# EAGLE design cigpack-batt_aaa (EAGLE 4.13)
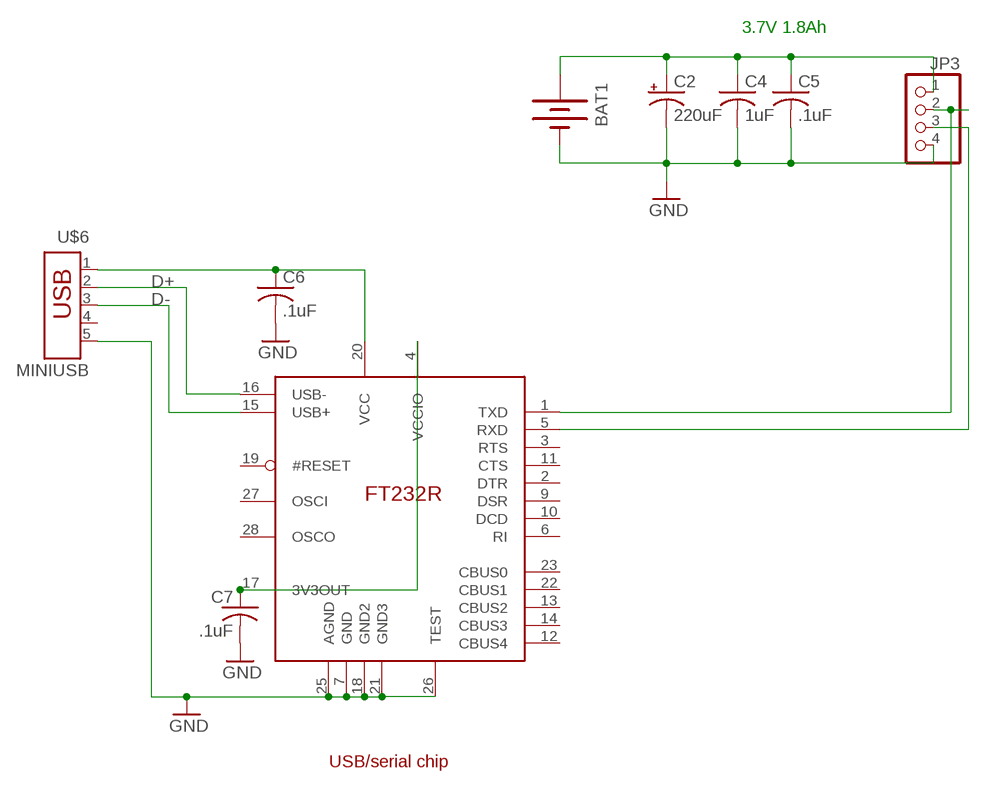
[diagram p0: schematic, sheet 1]

## Parts
BAT1  BATTERYAAA  [3AAA-PC]
C2  220uF  CPOL-US153CLV-0810  [153CLV-0810]
C4  1uF  C-USC3225  [C3225]
C5  .1uF  C-USC1206  [C1206]
C6  .1uF  C-USC1206  [C1206]
C7  .1uF  C-USC1206  [C1206]
IC2  FT232R  [TSSOP28]
JP3  PINHD-1X4  [1X04]
U$6  MINIUSB  [UX60A-MB-5SY]

## Nets
D+: IC2.16(USB-) U$6.2
D-: IC2.15(USB+) U$6.3
GND: BAT1.- C2.- C4.2 C5.2 C6.2 C7.2 IC2.7(GND) IC2.18(GND2) IC2.21(GND3) IC2.25(AGND) IC2.26(TEST) JP3.4 U$6.5
N$1: IC2.1(TXD) JP3.2
N$8: BAT1.+ C2.+ C4.1 C5.1 JP3.1
N$11: C6.1 IC2.20(VCC) U$6.1
N$17: C7.1 IC2.4(VCCIO) IC2.17(3V3OUT)
N$41: IC2.5(RXD) JP3.3
Unconnected: IC2.2(DTR) IC2.3(RTS) IC2.6(RI) IC2.9(DSR) IC2.10(DCD) IC2.11(CTS) IC2.12(CBUS4) IC2.13(CBUS2) IC2.14(CBUS3) IC2.19(#RESET) IC2.22(CBUS1) IC2.23(CBUS0) IC2.27(OSCI) IC2.28(OSCO) U$6.4

## Notes on the sheet
- 3.7V 1.8Ah
- USB/serial chip

## Library data of the parts
BAT1 = cleanair:BATTERY: BATTERY
C2 = rcl:CPOL-US: POLARIZED CAPACITOR, American symbol
C4-C7 = rcl:C-US: CAPACITOR, American symbol
IC2 = ft232:FT232R
JP3 = pinhead:PINHD-1X4: PIN HEADER
U$6 = cleanair:MINIUSB

## Board
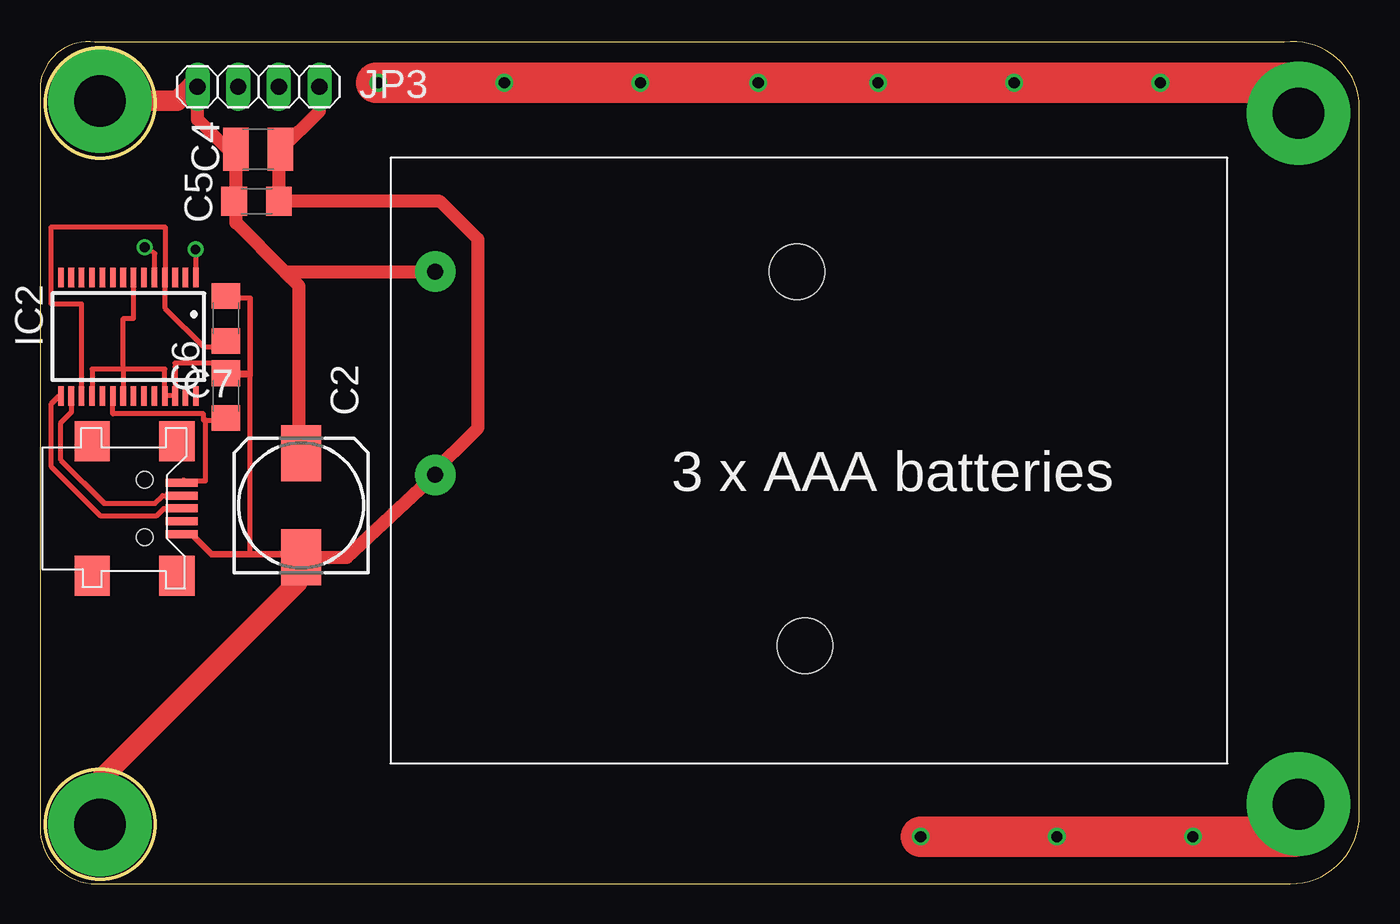
[diagram p1: board, top side]
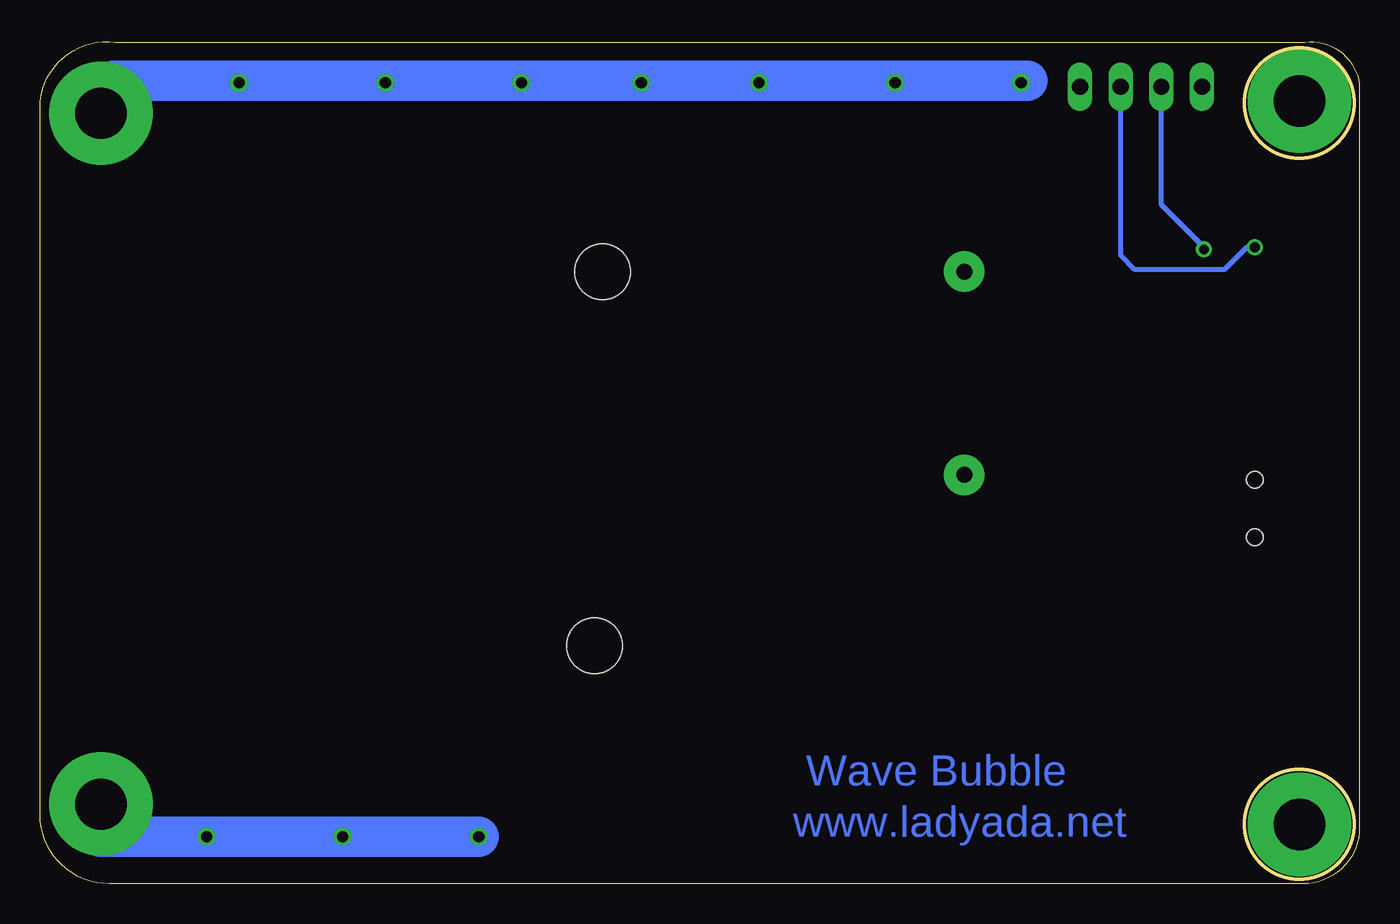
[diagram p2: board, bottom side, seen from below]

Size 82.49 x 52.63 mm. Coordinates in mm from the lower left corner, seen from the top.
Outline: 3.43,52.6 arc90 0,49.93 0,3.52 arc90 3.52,0 78.16,0 arc90 82.49,4.33 82.49,48.9 arc90 77.78,52.6 3.43,52.6
Outline: circle at 3.75,3.71 radius 3.43
Outline: circle at 3.75,48.79 radius 3.43
Copper layers (1*16): Top 0.035mm / dielectric 1.5mm / Bottom 0.035mm
Design rules "default": minimum track width 12mil, minimum drill 23mil, track to track 10mil, track to pad 10mil, pad to pad 10mil, via to via 10mil, smd to smd 1mil, copper to edge 20mil, drill to drill 8mil, minimum pad ring 10mil, minimum via ring 8mil, stop-mask expansion 4mil, vias tented up to drill 0mil, thermal gap 10mil

### Footprints (pad centres in the part's own frame; a part is rotated, then mirrored left to right if it is on the bottom)
3AAA-PC = drill 1 pad 2.54 round: + 23.368,-11.938; - 23.368,0.762 | hole 3.454: 0.762,-11.938; 0.254,11.43
153CLV-0810 = smd 3.5 x 2.5: + 3.25,0; - -3.25,0
C3225 = smd 1.6 x 2.7: 1 -1.4,0; 2 1.4,0
C1206 = smd 1.6 x 1.8: 1 -1.4,0; 2 1.4,0
TSSOP28 = smd 0.35 x 1.2: 1 -4.225,-3.7; 2 -3.575,-3.7; 3 -2.925,-3.7; 4 -2.275,-3.7; 5 -1.625,-3.7; 6 -0.975,-3.7; 7 -0.325,-3.7; 8 0.325,-3.7; 9 0.975,-3.7; 10 1.625,-3.7; 11 2.275,-3.7; 12 2.925,-3.7; 13 3.575,-3.7; 14 4.225,-3.7; 15 4.225,3.7; 16 3.575,3.7; 17 2.925,3.7; 18 2.275,3.7; 19 1.625,3.7; 20 0.975,3.7; 21 0.325,3.7; 22 -0.325,3.7; 23 -0.975,3.7; 24 -1.625,3.7; 25 -2.275,3.7; 26 -2.925,3.7; 27 -3.575,3.7; 28 -4.225,3.7
1X04 = drill 1.016 long: 1 -3.81,0; 2 -1.27,0; 3 1.27,0; 4 3.81,0
UX60A-MB-5SY = smd 0.5 x 2: 1 -1.6,2.3; 2 -0.8,2.3; 3 0,2.3; 4 0.8,2.3; 5 1.6,2.3 | smd 2.5 x 2.2: C1 -4.2,2; C2 -4.2,-3.3; C3 4.2,-3.3; C4 4.2,2 | hole 1.016: -1.8,0; 1.8,0

### Placement (x,y rotation side)
BAT1  48.08,26.31 180 top
C2  16.32,23.65 90 top
C4  13.64,45.89 0 top
C5  13.54,42.65 0 top
C6  11.63,30.5 90 top
C7  11.63,35.33 90 top
IC2  5.53,34.19 180 top
JP3  13.66,49.81 0 top
U$6  6.56,23.46 270 top

### Tracks (layer width: path | path; a pad name or v marks a point on that pad's centre or on a via)
19GHZANT  (via drill 0.7, 3.2 pad 6.45)
  Top 0.305: 78.68,3.83 78.81,3.96 | 78.68,3.83 78.55,3.83 78.43,2.95 | v78.68,4.98 78.68,3.83
  Top 2.54: v55.06,2.95 59.12,2.95 v63.57,2.95 67.76,2.95 v72.08,2.95 78.43,2.95
  Bottom 2.54: v55.06,2.95 59.12,2.95 v63.57,2.95 67.76,2.95 v72.08,2.95 78.68,2.95 v78.68,4.98
800MHZANT  (via drill 0.7, 3.2 pad 6.45)
  Top 0.305: 78.81,50.06 79.44,49.43 v78.68,48.16
  Top 0.406: 73.6,50.19 73.35,50.44 72.97,50.06
  Top 2.54: 21.02,50.06 v21.15,50.06 v29.02,50.06 v37.53,50.06 41.98,50.06 | 42.36,50.06 v52.39,50.06 v60.9,50.06 v70.05,50.06 72.97,50.06 78.81,50.06 | 41.98,50.06 v44.9,50.06 42.36,50.06 | 41.98,50.06 42.36,50.06
  Bottom 2.54: v78.68,48.16 78.68,49.81 77.92,50.19 20.77,50.19
D+
  Top 0.305: U$6.2 7.67,24.26 7.18,23.77 4.01,23.77 1.3,26.48 1.3,28.82 1.97,29.49 1.97,30.5 IC2.16
D-
  Top 0.305: U$6.3 7.75,23.46 7.31,23.01 3.75,23.01 0.7,26.06 0.7,30 1.21,30.5 1.23,30.49 IC2.15
GND  (via drill 3.2 pad 6.45)
  Top 0.305: 13.15,36.6 13.15,31.9 | C7.2 11.75,36.6 13.15,36.6 | 13.15,31.9 C6.2 12.01,31.77 13.15,31.77 13.15,31.9 | 7.94,30.49 IC2.25 7.81,32.16 5.15,32.16 | 7.94,30.49 IC2.26 8.46,32.29 8.45,32.29 | 7.94,30.49 7.94,30.5 | 5.21,32.16 IC2.21 | 5.21,32.16 5.21,35.33 5.86,35.33 IC2.7 | IC2.18 3.26,32.16 5.15,32.16 | 5.15,32.16 5.21,32.16 | 8.45,32.29 8.45,32.28 | 10.99,32.54 8.45,32.54 8.45,32.29 | 13.15,20.6 13.15,36.6
  Top 0.406: U$6.5 8.87,21.87 9.47,21.87 10.74,20.6 13.15,20.6 16.12,20.6 C2.- | C6.2 10.99,32.54
  Top 0.813: JP3.4 17.47,48.29 15.05,45.87 C4.2 15.04,45.6 14.93,45.49 14.94,45.48 C5.2 25.01,42.65 27.37,40.28 27.37,28.47 24.33,25.43 BAT1.- 19.17,20.4 C2.-
  Top 1.27: v3.75,3.71 3.75,6.5 16.07,18.82 16.07,20.22 16.25,20.4 C2.-
N$1  (via drill 0.6)
  Top 0.305: IC2.1 9.76,38.85 v9.72,39.65
  Bottom 0.305: v9.72,39.65 9.72,39.78 12.39,42.44 JP3.2
N$8  (via drill 3.2 pad 6.45)
  Top 0.813: JP3.1 9.85,47.78 11.75,45.87 11.78,45.89 C4.1 12.26,45.87 12.26,42.7 12.19,42.7 C5.1 12.14,42.31 12.26,42.19 12.26,41.3 15.31,38.25 | 15.31,38.25 BAT1.+ | C2.+ 16.25,26.82 16.2,26.82 16.2,37.36 15.31,38.25
  Top 1.27: JP3.1 9.47,49.81 8.58,48.92 v3.75,48.92
N$11
  Top 0.305: IC2.20 4.56,29.36 10.23,29.36 10.23,28.98 10.36,28.98 | C6.1 12,28.98 10.36,28.98 | 8.97,25.17 10.36,25.17 10.36,28.98
  Top 0.406: U$6.1 8.97,25.17
N$17
  Top 0.305: C7.1 11.75,33.55 10.23,33.55 7.81,35.98 IC2.4 7.81,38.24 7.82,38.25 7.82,41.05 0.7,41.05 0.7,36.22 2.6,36.22 IC2.17
N$41  (via drill 0.6)
  Top 0.305: IC2.5 7.16,37.89 7.18,39.4 v6.55,39.78
  Bottom 0.305: v6.55,39.78 7.05,39.78 8.45,38.38 14.04,38.38 14.93,39.27 JP3.3

### Text on the board
Bottom: Wave Bubble | www.ladyada.net